# EAGLE design T2103_ValSouffle (EAGLE 9.6.2)
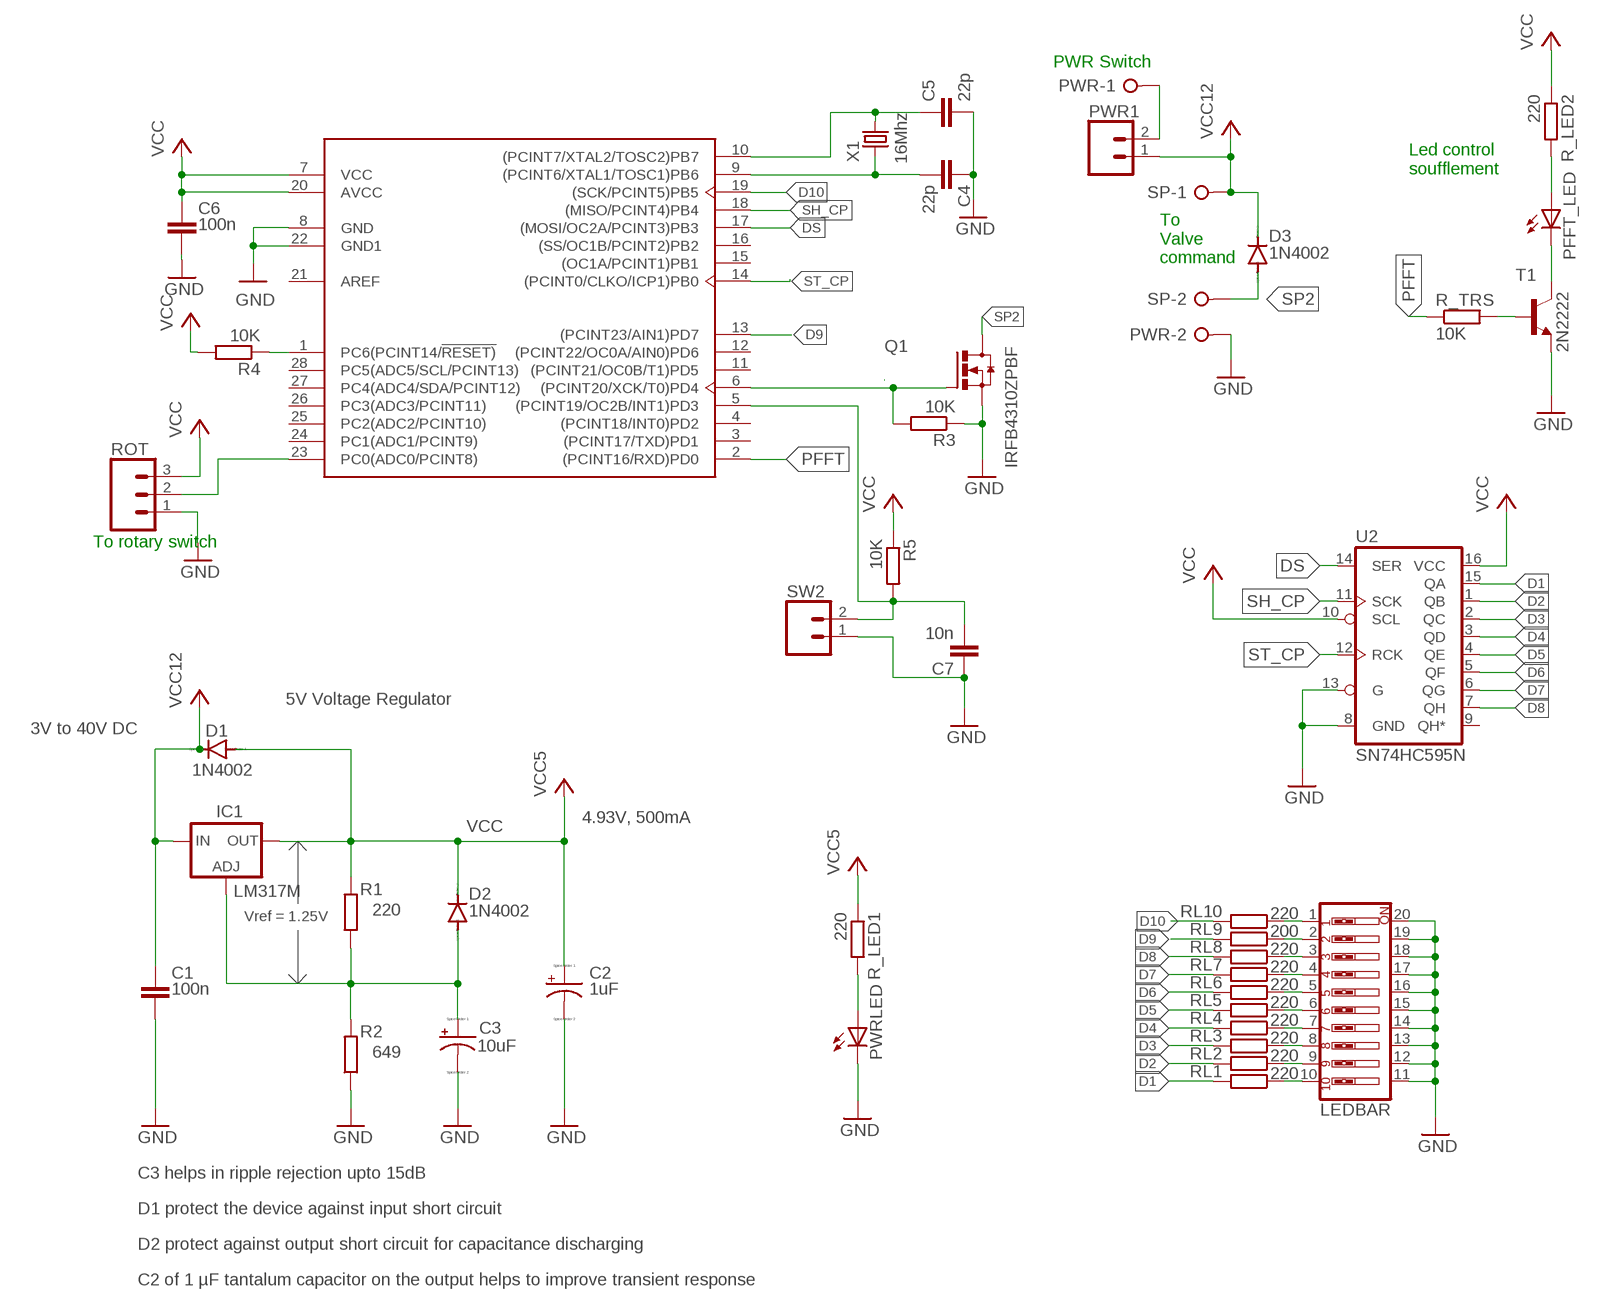
[diagram p0: schematic, sheet 1]

## Parts
C1  100n  C-EU050-030X075  [C050-030X075]
C2  1uF  CPOL-USE1.8-4  [E1,8-4]
C3  10uF  CPOL-USE1.8-4  [E1,8-4]
C4  22p  C-EU025-025X050  [C025-025X050]
C5  22p  C-EU025-025X050  [C025-025X050]
C6  100n  C-EU050-030X075  [C050-030X075]
C7  10n  C-EU025-025X050  [C025-025X050]
D1  1N4002  1N4004  [DO41-10]
D2  1N4002  1N4004  [DO41-10]
D3  1N4002  1N4004  [DO41-10]
IC1  LM317MB  [TO220L1]
LEDBAR  SW_DIP-10  [EDG-10]
PFFT_LED  LED5MM  [LED5MM]
PWR  W237-02P  [W237-132]
PWR1  CONN_02  [1X02]
PWRLED  LED5MM  [LED5MM]
Q1  IRFB4310ZPBF  IRF520NPBF  [TO-220]
R1  220  R-EU_0207/10  [0207/10]
R2  649  R-EU_0207/10  [0207/10]
R3  10K  R-EU_0207/10  [0207/10]
R4  10K  R-EU_0207/10  [0207/10]
R5  10K  R-EU_0207/10  [0207/10]
R_LED1  220  R-EU_0207/10  [0207/10]
R_LED2  220  R-EU_0207/10  [0207/10]
R_TRS  10K  R-EU_0207/10  [0207/10]
RL1  220  R-EU_0207/10  [0207/10]
RL2  220  R-EU_0207/10  [0207/10]
RL3  220  R-EU_0207/10  [0207/10]
RL4  220  R-EU_0207/10  [0207/10]
RL5  220  R-EU_0207/10  [0207/10]
RL6  220  R-EU_0207/10  [0207/10]
RL7  220  R-EU_0207/10  [0207/10]
RL8  220  R-EU_0207/10  [0207/10]
RL9  200  R-EU_0207/10  [0207/10]
RL10  220  R-EU_0207/10  [0207/10]
ROT  CONN_03  [1X03]
SP  W237-02P  [W237-132]
SW2  CONN_02  [1X02]
T1  2N2222  [TO92-EBC-OVAL]
U1  ATMEGA328P-PU  [DIP-28]
U2  SN74HC595N  74HC595N  [DIP16]
X1  16Mhz  49S/18PF  [XTAL_HC49]

## Nets
D1: RL1.2 U2.15(QA)
D2: RL2.2 U2.1(QB)
D3: RL3.2 U2.2(QC)
D4: RL4.2 U2.3(QD)
D5: RL5.2 U2.4(QE)
D6: RL6.2 U2.5(QF)
D7: RL7.2 U2.6(QG)
D8: RL8.2 U2.7(QH)
D9: RL9.2 U1.13((PCINT23/AIN1)PD7)
D10: RL10.2 U1.19((SCK/PCINT5)PB5)
DS: U1.17((MOSI/OC2A/PCINT3)PB3) U2.14(SER)
GND: C1.2 C2.- C3.- C4.1 C5.2 C6.2 C7.1 LEDBAR.11 LEDBAR.12 LEDBAR.13 LEDBAR.14 LEDBAR.15 LEDBAR.16 LEDBAR.17 LEDBAR.18 LEDBAR.19 LEDBAR.20 PWR.2 PWRLED.K(C) Q1.S R2.1 R3.1 ROT.1 SW2.1 T1.E U1.8(GND) U1.22(GND1) U2.8(GND) U2.13(G)
N$1: C3.+ D2.A IC1.1(ADJ) R1.1 R2.2
N$2: C4.2 U1.9((PCINT6/XTAL1/TOSC1)PB6) X1.1
N$3: C5.1 U1.10((PCINT7/XTAL2/TOSC2)PB7) X1.2
N$4: Q1.G R3.2 U1.6((PCINT20/XCK/T0)PD4)
N$5: R4.1 U1.1(PC6(PCINT14/!RESET))
N$6: LEDBAR.1 RL10.1
N$7: LEDBAR.2 RL9.1
N$8: LEDBAR.3 RL8.1
N$9: LEDBAR.4 RL7.1
N$10: LEDBAR.5 RL6.1
N$11: LEDBAR.6 RL5.1
N$12: LEDBAR.7 RL4.1
N$13: LEDBAR.8 RL3.1
N$14: LEDBAR.9 RL2.1
N$15: LEDBAR.10 RL1.1
N$17: ROT.2 U1.23(PC0(ADC0/PCINT8))
N$18: PFFT_LED.A R_LED2.2
N$19: PFFT_LED.K(C) T1.C
N$20: PWRLED.A R_LED1.2
N$21: R_TRS.2 T1.B
N$22: C7.2 R5.2 SW2.2 U1.5((PCINT19/OC2B/INT1)PD3)
PFFT: R_TRS.1 U1.2((PCINT16/RXD)PD0)
SH_CP: U1.18((MISO/PCINT4)PB4) U2.11(SCK)
SP2: D3.A Q1.D SP.2
ST_CP: U1.14((PCINT0/CLKO/ICP1)PB0) U2.12(RCK)
VCC: C2.+ C6.1 D1.A D2.C IC1.2(OUT) R1.2 R4.2 R5.1 R_LED1.1 R_LED2.1 ROT.3 U1.7(VCC) U1.20(AVCC) U2.10(SCL) U2.16(VCC) ; supply symbol labelled VCC5
VCC12: C1.1 D1.C D3.C IC1.3(IN) PWR1.1 SP.1
VCCSHUT: PWR1.2 PWR.1
Unconnected: U1.3((PCINT17/TXD)PD1) U1.4((PCINT18/INT0)PD2) U1.11((PCINT21/OC0B/T1)PD5) U1.12((PCINT22/OC0A/AIN0)PD6) U1.15((OC1A/PCINT1)PB1) U1.16((SS/OC1B/PCINT2)PB2) U1.21(AREF) U1.24(PC1(ADC1/PCINT9)) U1.25(PC2(ADC2/PCINT10)) U1.26(PC3(ADC3/PCINT11)) U1.27(PC4(ADC4/SDA/PCINT12)) U1.28(PC5(ADC5/SCL/PCINT13)) U2.9(QH*)

## Notes on the sheet
- PWR Switch
- Led control
  soufflement
- To
  Valve 
  command
- To rotary switch
- 5V Voltage Regulator
- 3V to 40V DC
- 4.93V, 500mA
- Vref = 1.25V
- C3 helps in ripple rejection upto 15dB
- D1 protect the device against input short circuit
- D2 protect against output short circuit for capacitance discharging
- C2 of 1 µF tantalum capacitor on the output helps to improve transient response

## Library data of the parts
C1 C6 = rcl:C-EU: CAPACITOR, European symbol; SPICEPREFIX: C
C2 C3 = resistor:CPOL-US: POLARIZED CAPACITOR, American symbol
C4 C5 C7 = resistor:C-EU: CAPACITOR, European symbol
D1-D3 = diode:1N4004: DIODE general purpose rectifier, 1 A
IC1 = v-reg:LM317?*: 500 mA Adjustable Output Positive Voltage Regulator Source: http://www.onsemi.co.jp .. LM317M-D.PDF; PARTNUMBER: LM317M
LEDBAR = special:SW_DIP-10: DIP SWITCH
PFFT_LED PWRLED = adafruit:LED: LED OSRAM: - CHIPLED LG R971, LG N971, LY N971, LG Q971, LY Q971, LO R971, LY R971 LH N974, LH R974 LS Q976, LO Q976, LY Q976 LO Q996 - Hyper CHIPLED LW Q18S LB Q993, LB Q99A, LB R99A - SideLED LS A670, LO A670, LY A670, LG A670, LP A670 LB A673, LV A673, LT A673, LW A673 LH A674 LY A675 LS A676, LA A676, LO A676, LY A676, LW A676 LS A679, LY A679, LG A679 - Hyper Micro SIDELED® LS Y876, LA Y876, LO Y876, LY Y876 LT Y87S - SmartLED LW L88C, LW L88S LB L89C, LB L89S, LG L890 LS L89K, LO L89K, LY L89K LS L896, LA L896, LO L896, LY L896 - TOPLED LS T670, LO T670, LY T670, LG T670, LP T670 LSG T670, LSP T670, LSY T670, LOP T670, LYG T670 LG T671, LOG T671, LSG T671 LB T673, LV T673, LT T673, LW T673 LH T674 LS T676, LA T676, LO T676, LY T676, LB T676, LH T676, LSB T676, LW T676 LB T67C, LV T67C, LT T67C, LS T67K, LO T67K, LY T67K, LW E67C LS E67B, LA E67B, LO E67B, LY E67B, LB E67C, LV E67C, LT E67C LW T67C LS T679, LY T679, LG T679 LS T770, LO T770, LY T770, LG T770, LP T770 LB T773, LV T773, LT T773, LW T773 LH T774 LS E675, LA E675, LY E675, LS T675 LS T776, LA T776, LO T776, LY T776, LB T776 LHGB T686 LT T68C, LB T68C - Hyper Mini TOPLED® LB M676 - Mini TOPLED Santana® LG M470 LS M47K, LO M47K, LY M47K Source: http://www.osram.convergy.de/
PWR SP = con-wago-508:W237-02P: WAGO SREW CLAMP; OC_FARNELL: unknown; OC_NEWARK: unknown
PWR1 SW2 = SparkFun-Connectors:CONN_02: Multi connection point. Often used as Generic Header-pin footprint for 0.1 inch spaced/style header connections On any of the 0.1 inch spaced packages, you can populate with these: Break Away Headers - Straight <https://www.sparkfun.com/products/116> (PRT-00116) Break Away Male Headers - Right Angle <https://www.sparkfun.com/products/553> (PRT-00553) Female Headers <https://www.sparkfun.com/products/115> (PRT-00115) Break Away Headers - Machine Pin <https://www.sparkfun.com/products/117> (PRT-00117) Break Away Female Headers - Swiss Machine Pin <https://www.sparkfun.com/products/743> (PRT-00743) For SCREWTERMINALS and SPRING TERMINALS visit here: Screw Terimnals on SparkFun.com <https://www.sparkfun.com/search/results?term=Screw+Terminals> (5mm/3.5mm/2.54mm spacing) This device is also useful as a general connection point to wire up your design to another part of your project. Our various solder wires solder well into these plated through hole pads. Hook-Up Wire - Assortment (Stranded, 22 AWG) <https://www.sparkfun.com/products/11375> (PRT-11375) Hook-Up Wire - Assortment (Solid Core, 22 AWG) <https://www.sparkfun.com/products/11367> (PRT-11367) View the entire wire category on our website here <https://www.sparkfun.com/categories/141> Special notes: Molex polarized connector foot print use with: PRT-08233 with associated crimp pins and housings. 2.54_SCREWTERM for use with PRT-10571. 3.5mm Screw Terminal footprints for PRT-08084 5mm Screw Terminal footprints for use with PRT-08432
Q1 = Transistor:IRF520NPBF: MOSFET N-CH 100V 9.7A TO-220AB Manufacturer's datasheet <https://www.infineon.com/dgdl/irf520npbf.pdf?fileId=5546d462533600a4015355e340711985>; CREATED_BY: PCBLayout.com; DIGIKEY_PART_NUMBER: IRF520NPBF-ND; MANUFACTURER: Infineon Technologies; MPN: IRF520NPBF; PACKAGE: TO-220
R1 R2 = rcl:R-EU_: RESISTOR, European symbol; SPICEPREFIX: R
R3-R5 R_LED1 R_LED2 R_TRS RL1-RL10 = resistor:R-EU_: RESISTOR, European symbol
ROT = SparkFun-Connectors:CONN_03: Multi connection point. Often used as Generic Header-pin footprint for 0.1 inch spaced/style header connections On any of the 0.1 inch spaced packages, you can populate with these: Break Away Headers - Straight <https://www.sparkfun.com/products/116> (PRT-00116) Break Away Male Headers - Right Angle <https://www.sparkfun.com/products/553> (PRT-00553) Female Headers <https://www.sparkfun.com/products/115> (PRT-00115) Break Away Headers - Machine Pin <https://www.sparkfun.com/products/117> (PRT-00117) Break Away Female Headers - Swiss Machine Pin <https://www.sparkfun.com/products/743> (PRT-00743) Stackable Header - 3 Pin (Female, 0.1") <https://www.sparkfun.com/products/13875> (PRT-13875) For SCREWTERMINALS and SPRING TERMINALS visit here: Screw Terimnals on SparkFun.com <https://www.sparkfun.com/search/results?term=Screw+Terminals> (5mm/3.5mm/2.54mm spacing) This device is also useful as a general connection point to wire up your design to another part of your project. Our various solder wires solder well into these plated through hole pads. Hook-Up Wire - Assortment (Stranded, 22 AWG) <https://www.sparkfun.com/products/11375> (PRT-11375) Hook-Up Wire - Assortment (Solid Core, 22 AWG) <https://www.sparkfun.com/products/11367> (PRT-11367) View the entire wire category on our website here <https://www.sparkfun.com/categories/141> Special notes: Molex polarized connector foot print use with SKU : PRT-08232 with associated crimp pins and housings.
T1 = adafruit:2N2222: NPN TRANSISTOR Big oval pads
U1 = Microcontroller:ATMEGA328P-PU: IC MCU 8BIT 32KB FLASH 28DIP Manufacturer's datasheet <http://ww1.microchip.com/downloads/en/DeviceDoc/ATmega48A-PA-88A-PA-168A-PA-328-P-DS-DS40002061A.pdf>; CREATED_BY: PCBLayout.com; DIGIKEY_PART_NUMBER: ATMEGA328P-PU-ND; MANUFACTURER: Microchip Technology; MPN: ATMEGA328P-PU; PACKAGE: DIP-28
U2 = SparkFun-IC-Logic:74*595: 8-Bit Shift Register (Serial to Parallel) Datasheet <http://cdn.sparkfun.com/datasheets/BreakoutBoards/MM74HC595.pdf> SparkFun Products SparkFun Shift Register Breakout - 74HC595 <https://www.sparkfun.com/products/10680> (BOB-10680); PROD_ID: IC-13123
X1 = Crystals:49S/18PF: Crystal Manufacturer's datasheet <https://datasheet.octopart.com/49S-18PF-Xinhunjing-datasheet-30677139.pdf>; CREATED_BY: PCBLayout.com; MANUFACTURER: Xinhunjing; MPN: 49S/18PF; PACKAGE: SMD

## Net classes
0 default: width 0.8 mm, clearance 0.4 mm

## Board
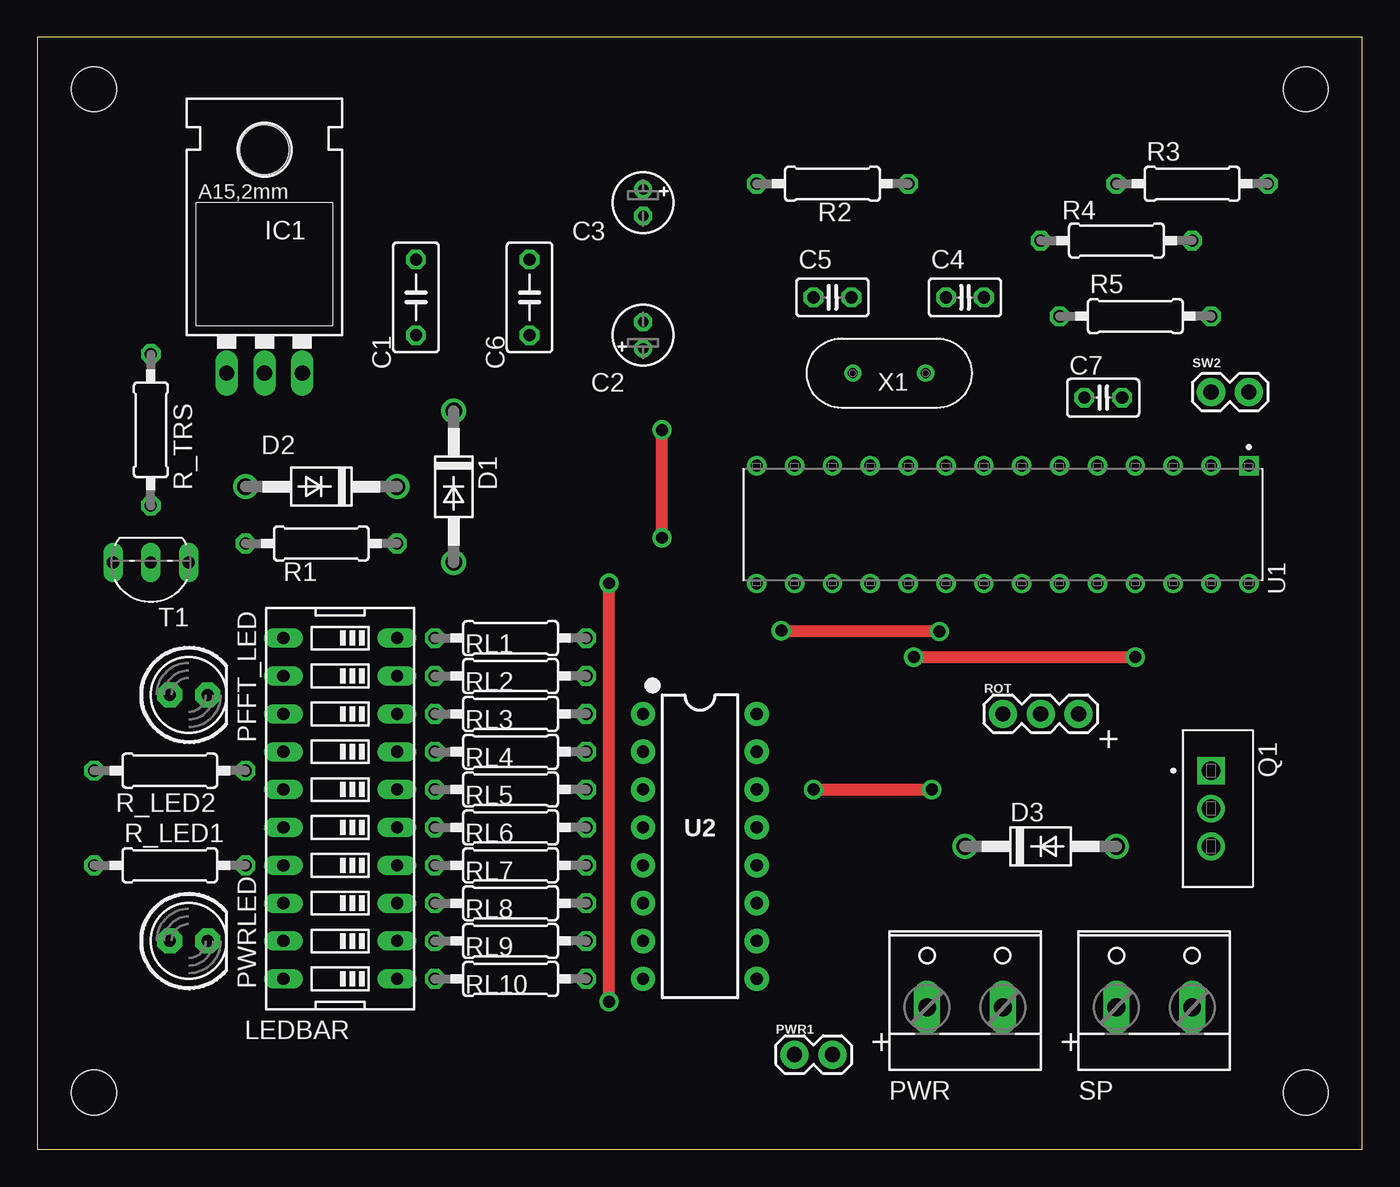
[diagram p1: board, top side]
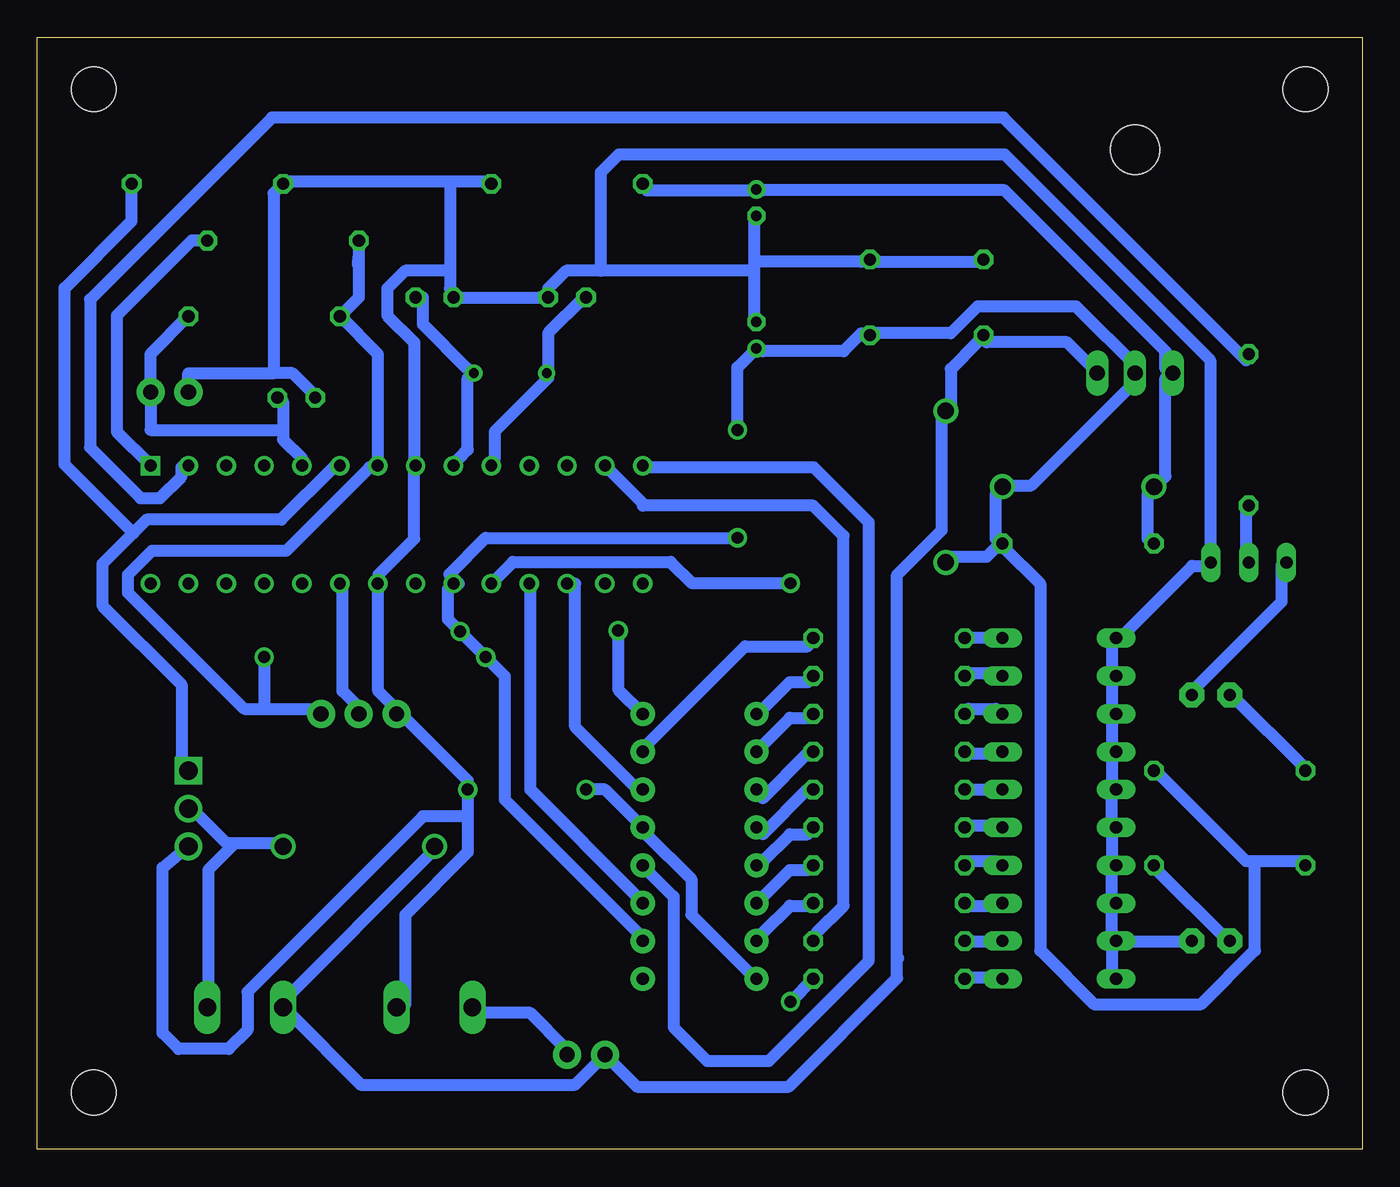
[diagram p2: board, bottom side, seen from below]

Size 88.88 x 74.6 mm. Coordinates in mm from the lower left corner, seen from the top.
Outline: 0,0 88.88,0 88.88,74.6 0,74.6 0,0
Copper layers (1*16): Top 0.035mm / dielectric 1.5mm / Bottom 0.035mm
Design rules "default": minimum track width 6mil, minimum drill 0.35mm, track to track 6mil, track to pad 6mil, pad to pad 6mil, via to via 6mil, smd to smd 6mil, copper to edge 40mil, drill to drill 6mil, minimum pad ring 10mil, minimum via ring 8mil, stop-mask expansion 4mil, vias tented up to drill 0mil, thermal gap 10mil
Holes 3 mm at 85.09,71.12 3.81,3.81 3.81,71.12 85.09,3.81

### Footprints (pad centres in the part's own frame; a part is rotated, then mirrored left to right if it is on the bottom)
C050-030X075 = drill 0.813 octagon: 1 -2.54,0; 2 2.54,0
E1,8-4 = drill 0.711 pad 1.168: + -0.889,0 | drill 0.711 pad 1.168 octagon: - 0.889,0
C025-025X050 = drill 0.813 octagon: 1 -1.27,0; 2 1.27,0
DO41-10 = drill 1.118: A 5.08,0; C -5.08,0
TO220L1 = drill 1.016 long: 1 -2.54,-3.81; 2 0,-3.81; 3 2.54,-3.81 | hole 3.302: 0,11.176
EDG-10 = drill 0.813 long: 1 -11.43,-3.81; 2 -8.89,-3.81; 3 -6.35,-3.81; 4 -3.81,-3.81; 5 -1.27,-3.81; 6 1.27,-3.81; 7 3.81,-3.81; 8 6.35,-3.81; 9 8.89,-3.81; 10 11.43,-3.81; 11 11.43,3.81; 12 8.89,3.81; 13 6.35,3.81; 14 3.81,3.81; 15 1.27,3.81; 16 -1.27,3.81; 17 -3.81,3.81; 18 -6.35,3.81; 19 -8.89,3.81; 20 -11.43,3.81
LED5MM = drill 0.813 pad 1.676 octagon: A -1.27,0; K 1.27,0
W237-132 = drill 1.194 long: 1 -2.54,-0.635; 2 2.54,-0.635
1X02 = drill 1.016 pad 1.88: 1 0,0; 2 2.54,0
TO-220 = drill 1.23 pad 1.85: D 2.54,0; S 5.08,0 | drill 1.23 pad 1.85 square: G 0,0
0207/10 = drill 0.813 octagon: 1 -5.08,0; 2 5.08,0
1X03 = drill 1.016 pad 1.88: 1 0,0; 2 2.54,0; 3 5.08,0
TO92-EBC-OVAL = drill 0.813 long: B 0,-1.27; C 2.54,-1.27; E -2.54,-1.27
DIP-28 = drill 0.79 pad 1.19 square: 1 -16.51,-3.95 | drill 0.79 pad 1.19: 2 -13.97,-3.95; 3 -11.43,-3.95; 4 -8.89,-3.95; 5 -6.35,-3.95; 6 -3.81,-3.95; 7 -1.27,-3.95; 8 1.27,-3.95; 9 3.81,-3.95; 10 6.35,-3.95; 11 8.89,-3.95; 12 11.43,-3.95; 13 13.97,-3.95; 14 16.51,-3.95; 15 16.51,3.95; 16 13.97,3.95; 17 11.43,3.95; 18 8.89,3.95; 19 6.35,3.95; 20 3.81,3.95; 21 1.27,3.95; 22 -1.27,3.95; 23 -3.81,3.95; 24 -6.35,3.95; 25 -8.89,3.95; 26 -11.43,3.95; 27 -13.97,3.95; 28 -16.51,3.95
DIP16 = drill 0.813 pad 1.626: 1 -8.89,-3.81; 2 -6.35,-3.81; 3 -3.81,-3.81; 4 -1.27,-3.81; 5 1.27,-3.81; 6 3.81,-3.81; 7 6.35,-3.81; 8 8.89,-3.81; 9 8.89,3.81; 10 6.35,3.81; 11 3.81,3.81; 12 1.27,3.81; 13 -1.27,3.81; 14 -3.81,3.81; 15 -6.35,3.81; 16 -8.89,3.81
XTAL_HC49 = drill 0.65 pad 1.05: 1 -2.44,0; 2 2.44,0

### Placement (x,y rotation side)
C1  25.4,57.15 90 top
C2  40.64,54.61 90 top
C3  40.64,63.5 270 top
C4  62.23,57.15 0 top
C5  53.34,57.15 0 top
C6  33.02,57.15 90 top
C7  71.5,50.42 0 top
D1  27.94,44.45 270 top
D2  19.05,44.45 180 top
D3  67.31,20.32 0 top
IC1  15.24,55.88 0 top
LEDBAR  20.32,22.86 90 top
PFFT_LED  10.16,30.48 0 top
PWR  62.23,10.16 0 top
PWR1  50.8,6.35 0 top
PWRLED  10.16,13.97 0 top
Q1  78.74,25.4 270 top
R1  19.05,40.64 0 top
R2  53.34,64.77 180 top
R3  77.47,64.77 0 top
R4  72.39,60.96 180 top
R5  73.66,55.88 0 top
R_LED1  8.89,19.05 0 top
R_LED2  8.89,25.4 180 top
R_TRS  7.62,48.26 270 top
RL1  31.75,34.29 0 top
RL2  31.75,31.75 0 top
RL3  31.75,29.21 0 top
RL4  31.75,26.67 0 top
RL5  31.75,24.13 0 top
RL6  31.75,21.59 0 top
RL7  31.75,19.05 0 top
RL8  31.75,16.51 0 top
RL9  31.75,13.97 0 top
RL10  31.75,11.43 0 top
ROT  64.77,29.21 0 top
SP  74.93,10.16 0 top
SW2  78.74,50.8 0 top
T1  7.62,38.1 180 top
U1  64.77,41.91 180 top
U2  44.45,20.32 270 top
X1  57.15,52.07 180 top

### Tracks (layer width: path | path; a pad name or v marks a point on that pad's centre or on a via)
D1
  Bottom 0.8: RL1.2 37.2,33.74 41.4,33.74 48,27.14 U2.15
D2
  Bottom 0.8: RL2.2 37.2,31.34 38.4,31.34 40.2,29.54 U2.1
D3
  Bottom 0.8: RL3.2 37.2,28.94 38.4,28.94 40.2,27.14 U2.2
D4
  Bottom 0.8: RL4.2 37.2,26.54 40.2,23.54 U2.3
D5
  Bottom 0.8: RL5.2 37.2,24.14 40.2,21.14 U2.4
D6
  Bottom 0.8: RL6.2 37.2,21.14 38.4,21.14 40.2,19.34 U2.5
D7
  Bottom 0.8: RL7.2 37.2,18.74 38.4,18.74 40.2,16.94 U2.6
D8
  Bottom 0.8: RL8.2 37.2,16.34 38.4,16.34 40.2,14.54 U2.7
D9
  Bottom 0.8: U1.13 48.26,43.32 48.26,43.18 36.83,43.18 34.8,41.15 34.8,16.34 36.6,14.54 RL9.2
D10  (via drill 0.8 pad 1.3)
  Top 0.8: v38.35,9.91 v38.35,37.97
  Bottom 0.8: RL10.2 v38.35,9.91 | v38.35,37.97 44.95,37.97 46.39,39.41 56.97,39.41 U1.19
DS
  Bottom 0.8: U1.17 52.8,37.94 52.8,28.34 48.6,24.14 U2.14
GND  (via drill 0.8 pad 1.3)
  Top 0.8: v52.07,24.13 v60,24.13
  Bottom 0.8: U2.8 40.8,11.54 45,15.74 45,18.14 48,21.14 U2.13 50.8,24.13 v52.07,24.13 | 60,22.34 v60,24.13 60,24.74 64.2,28.94 ROT.1 64.8,29.54 66,30.74 66,37.94 U1.22 66,38.54 63.6,40.94 63.6,45.74 U1.8 63.6,46.34 63.6,54.14 65.4,55.94 65.4,57.74 64.2,58.94 61.2,58.94 | 60,22.34 60,19.94 64.2,15.74 64.2,9.74 PWR.2 | 60,22.34 63,22.34 74.78,10.56 74.78,8 76.04,6.74 79.4,6.74 80.47,7.81 80.47,18.89 Q1.S | LEDBAR.20 16.8,11.54 16.8,13.94 LEDBAR.19 | LEDBAR.19 16.8,14.54 16.8,16.34 LEDBAR.18 16.8,16.94 16.8,18.74 LEDBAR.17 16.8,19.34 16.8,21.14 LEDBAR.16 16.8,21.74 16.8,23.54 LEDBAR.15 16.8,24.14 16.8,26.54 LEDBAR.14 16.8,27.14 16.8,28.94 LEDBAR.13 16.8,29.54 16.8,31.34 LEDBAR.12 16.8,31.94 16.8,33.74 LEDBAR.11 16.2,34.34 11.4,39.14 10.2,39.14 T1.E 10.2,39.74 10.2,52.94 24,66.74 49.87,66.74 51.07,65.54 51.07,58.94 | PWRLED.K 12,13.94 16.2,13.94 LEDBAR.19 | 61.2,64.94 71.82,64.94 R3.1 73.03,64.14 73.03,52.07 | 61.2,64.94 58.8,64.94 R2.1 | 61.2,64.94 61.2,58.94 | 61.2,58.94 61.2,57.74 C4.1 60.6,57.14 55.2,57.14 C5.2 54.6,57.74 53.4,58.94 51.07,58.94 | 40.8,59.54 40.8,62.54 C3.- | 40.8,59.54 40.8,58.94 | 40.8,58.94 40.8,55.94 C2.- | C1.2 25.8,59.54 33,59.54 C6.2 33.6,59.54 40.8,59.54 | 40.8,58.94 51.07,58.94 | 73.03,52.07 78.74,52.07 SW2.1 | C7.1 70.48,50.8 71.75,52.07 73.03,52.07
N$1
  Bottom 0.8: R2.2 48,64.34 40.8,64.34 C3.+ 40.2,64.34 24,64.34 13.2,53.54 13.2,52.34 IC1.1 13.2,51.74 13.2,45.14 13.8,44.54 D2.A 14.4,43.94 14.4,40.94 R1.1
N$2
  Bottom 0.8: U1.9 60.6,46.34 60,46.94 60,51.74 X1.1 60,52.34 63,55.34 63,57.14 C4.2
N$3
  Bottom 0.8: C5.1 52.2,57.14 54.6,54.74 54.6,52.34 X1.2 54.6,51.74 58.2,48.14 58.2,46.34 U1.10
N$4
  Bottom 0.8: 82.44,41.34 81.54,42.23 72.51,42.23 69,45.74 U1.6 | 82.44,41.34 84.51,39.27 84.51,36.49 79.2,31.18 79.2,25.94 Q1.G | 82.44,41.34 87.05,45.95 87.05,57.78 82.55,62.28 R3.2
N$5
  Bottom 0.8: U1.1 83.54,48.12 83.54,55.94 78.52,60.96 R4.1
N$6
  Bottom 0.8: LEDBAR.1 24.6,11.54 26.4,11.54 RL10.1
N$7
  Bottom 0.8: LEDBAR.2 24.6,13.94 26.4,13.94 RL9.1
N$8
  Bottom 0.8: LEDBAR.3 24.6,16.34 26.4,16.34 RL8.1
N$9
  Bottom 0.8: LEDBAR.4 24.6,19.34 26.4,19.34 RL7.1
N$10
  Bottom 0.8: LEDBAR.5 24.6,21.74 26.4,21.74 RL6.1
N$11
  Bottom 0.8: LEDBAR.6 24.6,24.14 26.4,24.14 RL5.1
N$12
  Bottom 0.8: LEDBAR.7 24.6,26.54 26.4,26.54 RL4.1
N$13
  Bottom 0.8: LEDBAR.8 24.6,29.54 26.4,29.54 RL3.1
N$14
  Bottom 0.8: LEDBAR.9 24.6,31.94 26.4,31.94 RL2.1
N$15
  Bottom 0.8: LEDBAR.10 24.6,34.34 26.4,34.34 RL1.1
N$17
  Bottom 0.8: U1.23 68.4,37.94 68.4,30.74 67.2,29.54 ROT.2
N$18
  Bottom 0.8: R_LED2.2 4.2,25.94 8.4,30.14 PFFT_LED.A
N$19
  Bottom 0.8: T1.C 5.4,39.14 5.4,36.74 11.4,30.74 PFFT_LED.K
N$20
  Bottom 0.8: R_LED1.2 13.8,18.74 9,13.94 PWRLED.A
N$21
  Bottom 0.8: T1.B 7.8,39.74 7.8,42.74 R_TRS.2
N$22
  Bottom 0.8: 72.39,48.26 72.39,50.16 C7.2 | 72.39,48.26 72.39,47.62 71.12,46.35 U1.5 | R5.2 81.28,53.34 SW2.2 81.28,48.26 72.39,48.26
PFFT
  Bottom 0.8: U1.2 79.2,45.74 79.2,45.14 80.65,43.69 81.95,43.69 85.34,47.08 85.34,57 73.13,69.21 24.07,69.21 7.8,52.94 R_TRS.1
SH_CP
  Bottom 0.8: U1.18 55.8,37.94 55.8,24.14 48.6,16.94 U2.11
SP2
  Bottom 0.8: 75.6,20.54 76.2,20.54 78.6,22.94 Q1.D | 75.6,20.54 72.6,20.54 D3.A | 75.6,20.54 77.4,18.74 77.4,9.74 SP.2
ST_CP
  Bottom 0.8: U1.14 48,45.74 36.78,45.74 33.09,42.05 33.09,12.65 39.81,5.93 43.94,5.93 46.2,8.19 46.2,16.94 48,18.74 U2.12
VCC  (via drill 0.8 pad 1.3)
  Top 0.8: v41.91,41.02 v41.91,48.26 | v58.8,33.02 v73.66,33.02 | v60.52,34.73 49.97,34.73 v49.91,34.8
  Bottom 0.8: 48,29.54 U2.16 49.91,30.86 v49.91,34.8 | U2.10 48.6,14.54 57.53,23.47 57.53,31.75 v58.8,33.02 v60.52,34.73 61.34,35.56 61.34,37.58 U1.20 60.6,37.94 61.23,38.57 58.8,41.01 v41.91,41.01 v41.91,41.02 | 7.2,19.34 7.8,19.34 13.8,25.34 R_LED2.1 | 7.2,19.34 4.2,19.34 R_LED1.1 | R1.2 24.6,40.94 24.6,43.94 D2.C 24,44.54 22.2,44.54 15.6,51.14 15.6,51.74 IC1.2 15,52.34 19.2,56.54 25.8,56.54 27.6,54.74 33,54.74 C6.1 33.6,54.74 34.8,53.54 40.2,53.54 C2.+ 41.91,52.45 v41.91,48.26 | 7.2,19.34 7.2,13.34 10.8,9.74 18,9.74 21.6,13.34 21.6,37.94 24,40.34 R1.2 | 67.36,59.38 67.31,59.88 | R4.2 67.31,59.88 | 73.66,29.54 75,29.54 82.8,37.34 82.8,38.54 81.2,40.14 72.2,40.14 66.6,45.74 U1.7 66.04,53.34 R5.1 67.31,57.15 67.31,59.88 | 73.66,29.54 70.2,29.54 ROT.3 | D1.A 27.6,39.74 25.2,39.74 24.6,40.34 R1.2 | v73.66,33.02 73.66,29.54
VCC12
  Bottom 0.8: IC1.3 18,52.34 19.8,54.14 25.2,54.14 C1.1 25.8,54.14 27.6,52.34 27.6,49.94 D1.C 28.2,49.34 28.2,41.54 31.2,38.54 31.2,12.74 | D3.C 62.4,19.94 72.6,9.74 SP.1 72,9.14 67.2,4.34 52.8,4.34 51,6.14 PWR1.1 48.65,4.2 38.47,4.2 31.2,11.47 31.2,12.74 | 31.2,12.74 31.13,12.81
VCCSHUT
  Bottom 0.8: PWR.1 59.4,9.14 55.8,9.14 53.4,6.74 PWR1.2

### Text on the board
tNames: + | + | +